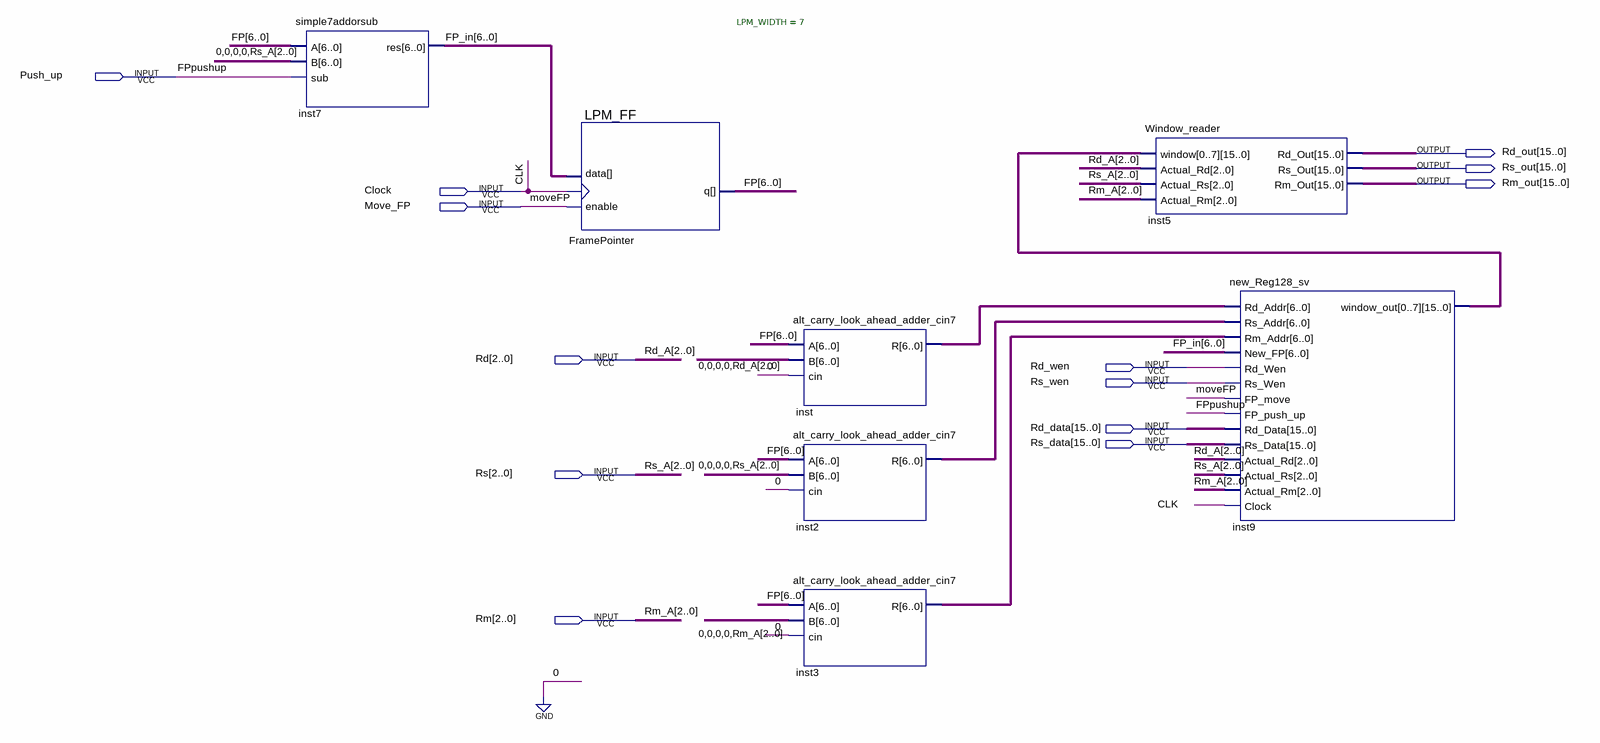
[diagram p0: schematic sheet]
// Quartus schematic new_RegisterStack.bdf as structural Verilog: 7 symbols, 13 pins
module new_RegisterStack (
  input  Push_up,
  input  Clock,
  input  Move_FP,
  input  [2:0] Rd,
  input  Rd_wen,
  input  Rs_wen,
  input  [15:0] Rd_data,
  input  [15:0] Rs_data,
  input  [2:0] Rs,
  input  [2:0] Rm,
  output [15:0] Rd_out,
  output [15:0] Rs_out,
  output [15:0] Rm_out
);

  wire [6:0] FP, FP_in, inst2_r, inst3_r, inst_r;
  wire [127:0] inst9_window_out;

  simple7addorsub inst7 (.A(FP), .B({4'b0000, Rs}), .sub(Push_up), .res(FP_in));
  LPM_FF #(.LPM_WIDTH(7)) FramePointer (.enable(Move_FP), .clock(Clock), .data(FP_in), .q(FP));
  alt_carry_look_ahead_adder_cin7 inst (.A(FP), .B({4'b0000, Rd}), .cin(1'b0), .R(inst_r));
  alt_carry_look_ahead_adder_cin7 inst2 (.A(FP), .B({4'b0000, Rs}), .cin(1'b0), .R(inst2_r));
  alt_carry_look_ahead_adder_cin7 inst3 (.A(FP), .B({4'b0000, Rm}), .cin(1'b0), .R(inst3_r));
  Window_reader inst5 (
    .window(inst9_window_out), .Actual_Rd(Rd), .Actual_Rs(Rs), .Actual_Rm(Rm), .Rd_Out(Rd_out),
    .Rs_Out(Rs_out), .Rm_Out(Rm_out));
  new_Reg128_sv inst9 (
    .Rd_Addr(inst_r), .Rs_Addr(inst2_r), .Rm_Addr(inst3_r), .New_FP(FP_in), .Rd_Wen(Rd_wen), .Rs_Wen(Rs_wen),
    .FP_move(Move_FP), .FP_push_up(Push_up), .Rd_Data(Rd_data), .Rs_Data(Rs_data), .Actual_Rd(Rd),
    .Actual_Rs(Rs), .Actual_Rm(Rm), .Clock(Clock), .window_out(inst9_window_out));

  // Other names for the same wires on the sheet: CLK = Clock; FPpushup = Push_up; moveFP = Move_FP; Rd_A[2:0] = Rd;
  //   Rm_A[2:0] = Rm; Rs_A[2:0] = Rs
endmodule
